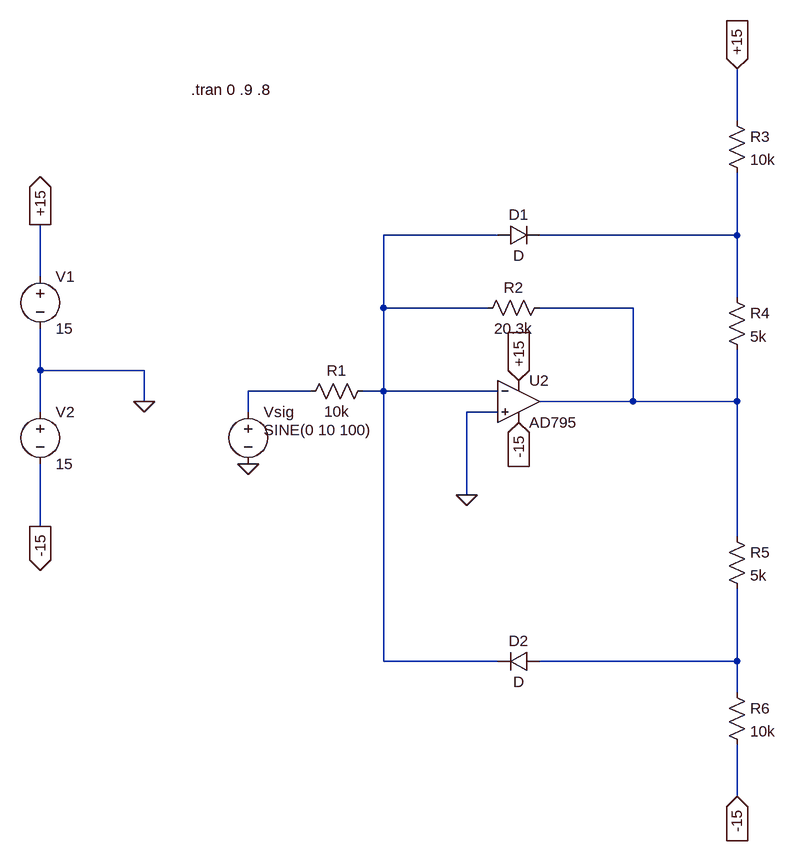
[diagram p0: schematic Limitador_nao_linear.asc]
Limitador_nao_linear.asc, the LTspice schematic file:
Version 4
SHEET 1 1000 912
WIRE 528 -240 528 -320
WIRE 160 -64 -16 -64
WIRE 528 -64 528 -160
WIRE 528 -64 224 -64
WIRE -544 0 -544 -80
WIRE 528 32 528 -64
WIRE -16 48 -16 -64
WIRE 144 48 -16 48
WIRE 368 48 224 48
WIRE -544 144 -544 80
WIRE -384 144 -544 144
WIRE -128 176 -224 176
WIRE -16 176 -16 48
WIRE -16 176 -48 176
WIRE 160 176 -16 176
WIRE -384 192 -384 144
WIRE 368 192 368 48
WIRE 368 192 224 192
WIRE 528 192 528 112
WIRE 528 192 368 192
WIRE -544 208 -544 144
WIRE -224 208 -224 176
WIRE 160 208 112 208
WIRE 112 336 112 208
WIRE -544 384 -544 288
WIRE 528 400 528 192
WIRE -16 592 -16 176
WIRE 160 592 -16 592
WIRE 528 592 528 480
WIRE 528 592 224 592
WIRE 528 640 528 592
WIRE 528 800 528 720
FLAG 112 336 0
FLAG 528 -320 +15
IOPIN 528 -320 In
FLAG 528 800 -15
IOPIN 528 800 In
FLAG -384 192 0
FLAG -544 -80 +15
IOPIN -544 -80 Out
FLAG -544 384 -15
IOPIN -544 384 Out
FLAG 192 160 +15
IOPIN 192 160 In
FLAG 192 224 -15
IOPIN 192 224 In
FLAG -224 288 0
SYMBOL res 240 32 R90
WINDOW 0 0 56 VBottom 2
WINDOW 3 32 56 VTop 2
SYMATTR InstName R2
SYMATTR Value 20.3k
SYMBOL res -32 160 R90
WINDOW 0 0 56 VBottom 2
WINDOW 3 32 56 VTop 2
SYMATTR InstName R1
SYMATTR Value 10k
SYMBOL diode 160 -48 R270
WINDOW 0 32 32 VTop 2
WINDOW 3 0 32 VBottom 2
SYMATTR InstName D1
SYMBOL diode 224 576 R90
WINDOW 0 0 32 VBottom 2
WINDOW 3 32 32 VTop 2
SYMATTR InstName D2
SYMBOL res 512 384 R0
SYMATTR InstName R5
SYMATTR Value 5k
SYMBOL res 512 16 R0
SYMATTR InstName R4
SYMATTR Value 5k
SYMBOL res 512 -256 R0
SYMATTR InstName R3
SYMATTR Value 10k
SYMBOL res 512 624 R0
SYMATTR InstName R6
SYMATTR Value 10k
SYMBOL voltage -544 -16 R0
WINDOW 123 0 0 Left 2
WINDOW 39 24 124 Left 2
SYMATTR InstName V1
SYMATTR Value 15
SYMBOL voltage -544 192 R0
WINDOW 123 0 0 Left 2
WINDOW 39 0 0 Left 2
SYMATTR InstName V2
SYMATTR Value 15
SYMBOL Opamps\\AD795 192 128 R0
SYMATTR InstName U2
SYMBOL voltage -224 192 R0
WINDOW 3 24 44 Left 2
WINDOW 123 0 0 Left 2
WINDOW 39 0 0 Left 2
SYMATTR Value SINE(0 10 100)
SYMATTR InstName Vsig
TEXT -312 -288 Left 2 !.tran 0 .9 .8

The netlist it stands for:
* Limitador_nao_linear.asc
R2 N003 N001 20.3k
R1 N001 N004 10k
D1 N001 N002 D
D2 N005 N001 D
R5 N003 N005 5k
R4 N002 N003 5k
R3 +15 N002 10k
R6 N005 -15 10k
V1 +15 0 15
V2 0 -15 15
XU2 0 N001 +15 -15 N003 AD795  ; pins In+ In- V+ V- OUT
Vsig N004 0 SINE(0 10 100)
.model D D
.lib standard.dio
.tran 0 .9 .8
.lib ADI1.lib
.backanno
.end